# EAGLE board robot_board (EAGLE 6.5.0)
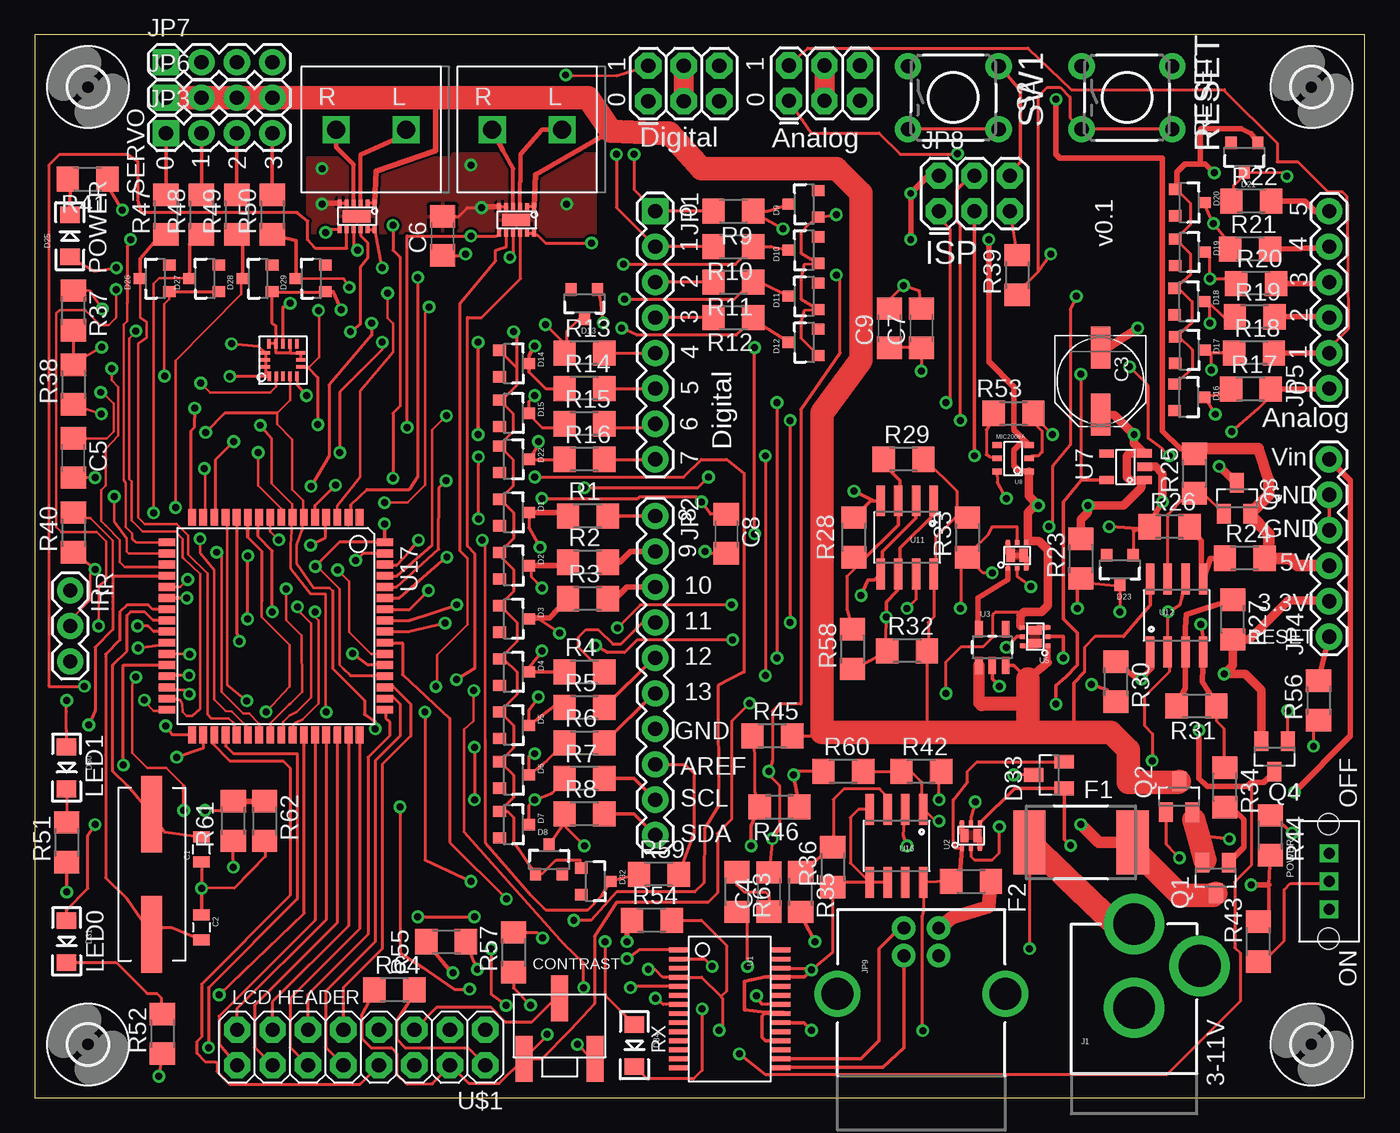
[diagram p1: board, top side]
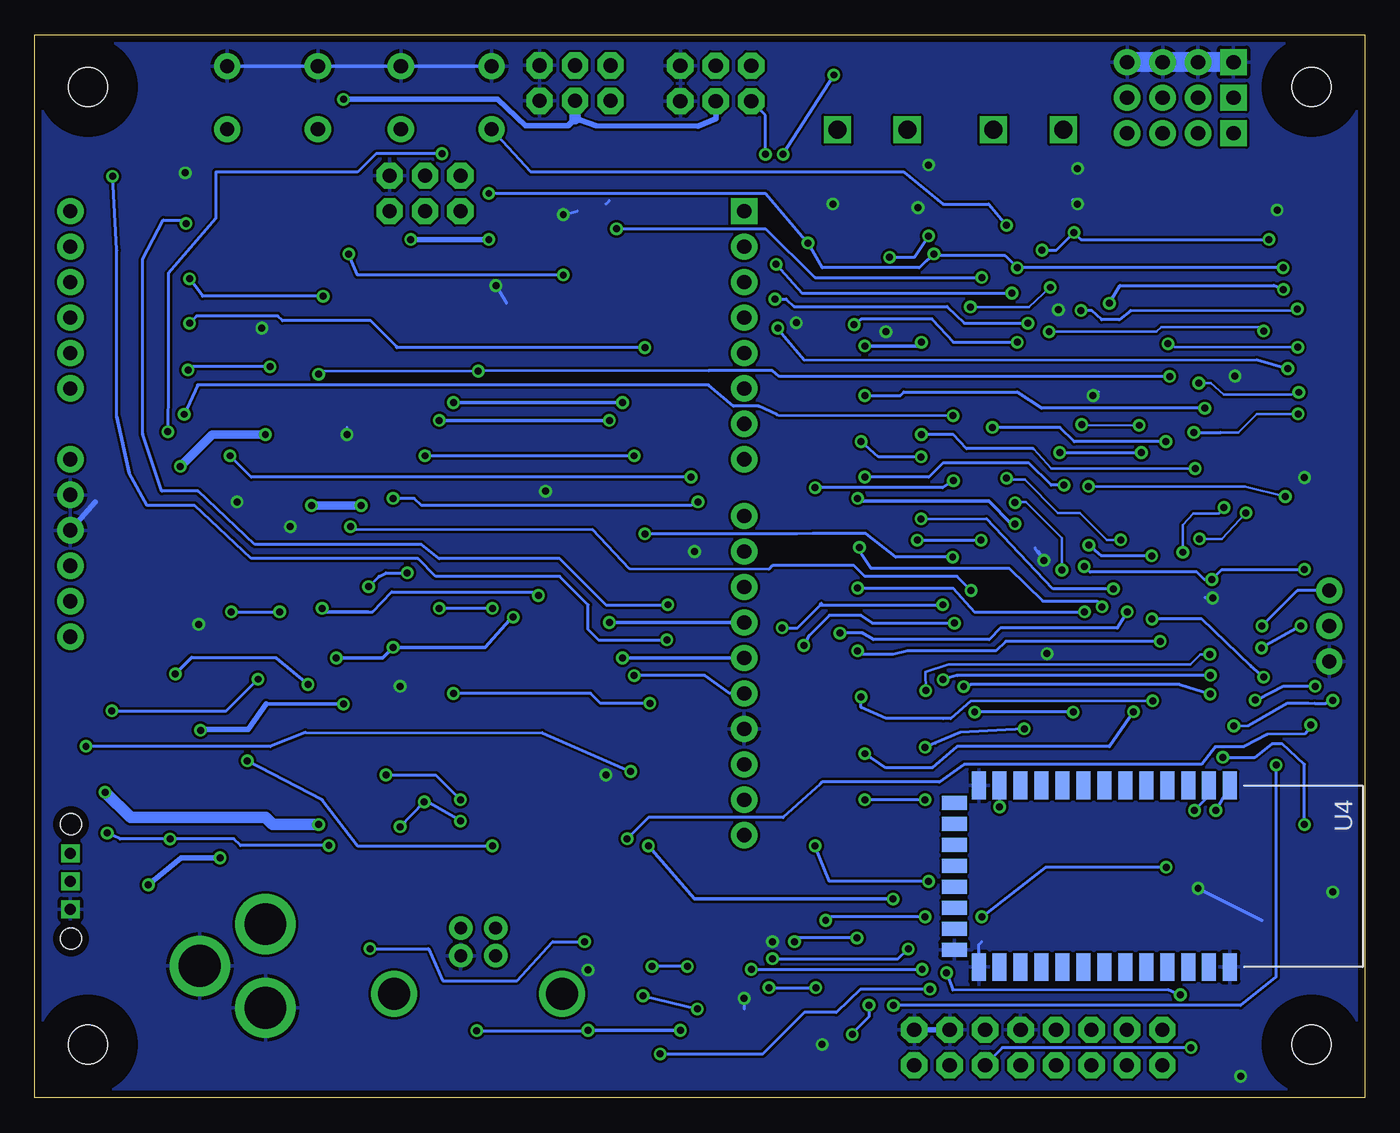
[diagram p2: board, bottom side, seen from below]

Size 95.24 x 76.12 mm. Coordinates in mm from the lower left corner, seen from the top.
Outline: 95.24,0 95.24,76.12 0,76.12 0,0 95.24,0
Copper layers (1*16): Top 0.035mm / dielectric 1.5mm / Bottom 0.035mm
Design rules "default *": minimum track width 7mil, minimum drill 19mil, track to track 7mil, track to pad 8mil, pad to pad 8mil, via to via 8mil, smd to smd 1mil, copper to edge 20mil, drill to drill 8mil, minimum pad ring 10mil, minimum via ring 8mil, stop-mask expansion 4mil, vias tented up to drill 0mil, thermal gap 10mil

## Footprints (pad centres in the part's own frame; a part is rotated, then mirrored left to right if it is on the bottom)
0805 = smd 0.8 x 1.2: 1 -0.9,0; 2 0.9,0
PANASONIC_D = smd 3 x 1.4: + 2.4,0; - -2.4,0
C1206 = smd 1.6 x 1.8: 1 -1.4,0; 2 1.4,0
SOT23-3 = smd 0.8 x 0.9: 1 -0.95,-1; 2 0.95,-1; 3 0,1.1
LED-1206 = smd 1.2 x 1.4: A -1.5,0; C 1.5,0
SOT23 = smd 1 x 1.4: 1 -0.95,-1.1; 2 0.95,-1.1; 3 0,1.1
SMD050F = smd 2.3 x 4.6: 1 -3.7,0; 2 3.7,0
R1206 = smd 1.6 x 1.803: 1 -1.422,0; 2 1.422,0
2,8 = hole 2.8: 0,0
1X03 = drill 1.016 pad 1.88: 1 0,0; 2 2.54,0; 3 5.08,0
POWER_JACK_PTH = drill 2.997 pad 4.318: GND 0,7.7; GNDBREAK 4.7,10.7; PWR 0,13.7
1X08 = drill 1.016 pad 1.88 square: 1 0,0 | drill 1.016 pad 1.88: 2 2.54,0; 3 5.08,0; 4 7.62,0; 5 10.16,0; 6 12.7,0; 7 15.24,0; 8 17.78,0
1X10 = drill 1.016 pad 1.88: 1 0,0; 2 2.54,0; 3 5.08,0; 4 7.62,0; 5 10.16,0; 6 12.7,0; 7 15.24,0; 8 17.78,0; 9 20.32,0; 10 22.86,0
1X04 = drill 1.016 pad 1.88 square: 1 0,0 | drill 1.016 pad 1.88: 2 2.54,0; 3 5.08,0; 4 7.62,0
1X06 = drill 1.016 pad 1.88: 1 0,0; 2 2.54,0; 3 5.08,0; 4 7.62,0; 5 10.16,0; 6 12.7,0
2X3 = drill 1.016 pad 1.88 octagon: 1 0,0; 2 0,2.54; 3 2.54,0; 4 2.54,2.54; 5 5.08,0; 6 5.08,2.54
USB-B-PTH = drill 0.914 pad 1.676: D+ 0,1.25; D- 1.981,1.25; GND 0,-1.25; VBUS 1.981,-1.25 | drill 2.286: S1 -2.718,-6.02; S2 -2.718,6.02
SW = drill 0.8 square: P$1 0,0; P$2 2,0; P$3 -2,0 | hole 1.5: -4.1,-0.04; 4.1,-0.04
SOT23@1 = smd 1 x 1.4: 1 -0.95,-1.1; 2 0.95,-1.1; 3 0,1.1
TACTILE-PTH = drill 1.016 pad 1.88: 1 -3.251,2.261; 2 3.251,2.261; 3 -3.251,-2.261; 4 3.251,-2.261
SSOP28DB = smd 0.348 x 1.397: 1 -4.225,-3.656; 2 -3.575,-3.656; 3 -2.925,-3.656; 4 -2.275,-3.656; 5 -1.625,-3.656; 6 -0.975,-3.656; 7 -0.325,-3.656; 8 0.325,-3.656; 9 0.975,-3.656; 10 1.625,-3.656; 11 2.275,-3.656; 12 2.925,-3.656; 13 3.575,-3.656; 14 4.225,-3.656; 15 4.225,3.656; 16 3.575,3.656; 17 2.925,3.656; 18 2.275,3.656; 19 1.625,3.656; 20 0.975,3.656; 21 0.325,3.656; 22 -0.325,3.656; 23 -0.975,3.656; 24 -1.625,3.656; 25 -2.275,3.656; 26 -2.925,3.656; 27 -3.575,3.656; 28 -4.225,3.656
SC70T = smd 0.3 x 0.35: D1 -0.65,0.89; D2 0.65,-0.94; G1 0,-0.94; G2 0,0.89; S1 -0.65,-0.94; S2 0.65,0.89 | smd 0.6 x 0.95: D1@ -0.47,-0.02; D2@ 0.46,-0.02
SOT23-5 = smd 0.55 x 1.2: 1 -0.95,-1.3; 2 0,-1.3; 3 0.95,-1.3; 4 0.95,1.3; 5 -0.95,1.3
BLUETOOTH_SMD = smd 2 x 1: 1 0,0; 2 0,-1.5; 3 0,-3; 4 0,-4.5; 5 0,-6; 6 0,-7.5; 7 0,-9; 8 0,-10.5; 9 0,-12; 10 0,-13.5; 11 0,-15; 12 0,-16.5; 13 0,-18; 22 13,-18; 23 13,-16.5; 24 13,-15; 25 13,-13.5; 26 13,-12; 27 13,-10.5; 28 13,-9; 29 13,-7.5; 30 13,-6; 31 13,-4.5; 32 13,-3; 33 13,-1.5; 34 13,0 | smd 1 x 1.8: 14 1.25,-19.75; 15 2.75,-19.75; 16 4.25,-19.75; 17 5.75,-19.75; 18 7.25,-19.75; 19 8.75,-19.75; 20 10.25,-19.75; 21 11.75,-19.75
SOT-23-5 = smd 1.05 x 0.6: P$1 0.53,2.24; P$2 0.53,1.29; P$3 0.53,0.34; P$4 3.23,2.24; P$5 3.23,0.35
SOT23-M5 = smd 0.4 x 0.7: P$1 -0.62,-0.35; P$2 0.33,-0.35; P$3 1.28,-0.35; P$4 1.28,1.94; P$5 0.33,1.94; P$6 -0.62,1.94
PWSON-N12 = smd 2 x 0.9: GND 0.82,0.63 | smd 0.28 x 0.5: P$1 -0.46,-0.32; P$2 0.04,-0.32; P$3 0.54,-0.32; P$4 1.04,-0.32; P$5 1.54,-0.32; P$6 2.04,-0.32; P$7 -0.46,1.58; P$8 0.04,1.58; P$9 0.54,1.58; P$10 1.04,1.58; P$11 1.54,1.58; P$12 2.04,1.58
SO08 = smd 0.61 x 2.21: 1 -1.905,-2.616; 2 -0.635,-2.616; 3 0.635,-2.616; 4 1.905,-2.616; 5 1.905,2.616; 6 0.635,2.616; 7 -0.635,2.616; 8 -1.905,2.616
TQFP64 = smd 1.194 x 0.559: 1 -7.8,6; 2 -7.8,5.2; 3 -7.8,4.4; 4 -7.8,3.6; 5 -7.8,2.8; 6 -7.8,2; 7 -7.8,1.2; 8 -7.8,0.4; 9 -7.8,-0.4; 10 -7.8,-1.2; 11 -7.8,-2; 12 -7.8,-2.8; 13 -7.8,-3.6; 14 -7.8,-4.4; 15 -7.8,-5.2; 16 -7.8,-6; 33 7.8,-6; 34 7.8,-5.2; 35 7.8,-4.4; 36 7.8,-3.6; 37 7.8,-2.8; 38 7.8,-2; 39 7.8,-1.2; 40 7.8,-0.4; 41 7.8,0.4; 42 7.8,1.2; 43 7.8,2; 44 7.8,2.8; 45 7.8,3.6; 46 7.8,4.4; 47 7.8,5.2; 48 7.8,6 | smd 0.559 x 1.194: 17 -6,-7.8; 18 -5.2,-7.8; 19 -4.4,-7.8; 20 -3.6,-7.8; 21 -2.8,-7.8; 22 -2,-7.8; 23 -1.2,-7.8; 24 -0.4,-7.8; 25 0.4,-7.8; 26 1.2,-7.8; 27 2,-7.8; 28 2.8,-7.8; 29 3.6,-7.8; 30 4.4,-7.8; 31 5.2,-7.8; 32 6,-7.8; 49 6,7.8; 50 5.2,7.8; 51 4.4,7.8; 52 3.6,7.8; 53 2.8,7.8; 54 2,7.8; 55 1.2,7.8; 56 0.4,7.8; 57 -0.4,7.8; 58 -1.2,7.8; 59 -2,7.8; 60 -2.8,7.8; 61 -3.6,7.8; 62 -4.4,7.8; 63 -5.2,7.8; 64 -6,7.8
2X8 = drill 1.016 pad 1.88 octagon: 1 0,0; 2 0,2.54; 3 2.54,0; 4 2.54,2.54; 5 5.08,0; 6 5.08,2.54; 7 7.62,0; 8 7.62,2.54; 9 10.16,0; 10 10.16,2.54; 11 12.7,0; 12 12.7,2.54; 13 15.24,0; 14 15.24,2.54; 15 17.78,0; 16 17.78,2.54
POT = smd 1.194 x 3.302: 1 -2.54,0; 2 0,4.318; 3 2.54,0
QFN-COL = smd 0.67 x 0.25: P$1 -1.17,0.99; P$2 -1.17,0.49; P$3 -1.17,-0.01; P$4 -1.17,-0.51; P$5 -1.17,-1.01; P$9 1.17,-1; P$10 1.17,-0.5; P$11 1.17,0; P$12 1.17,0.5; P$13 1.17,1 | smd 0.25 x 0.67: P$6 -0.5,-1.26; P$7 0,-1.26; P$8 0.5,-1.26; P$14 0.5,1.26; P$15 0,1.26; P$16 -0.5,1.26
2POS_TERMINAL = drill 1.3 square: L -5,0; R 0,0
CRYSTAL-SMD-10.5X4.8-2PIN = smd 5.5 x 1.5: P$1 -4.3,0; P$2 4.3,0

## Placement (x,y rotation side)
C1  22pF  [0805]  11.93,17.78 90 top
C2  22pF  [0805]  11.93,12.19 270 top
C3  100uF  [PANASONIC_D]  76.32,51.33 270 top
C4  .1uF  [C1206]  52.57,14.73 90 top
C5  .1uF  [C1206]  2.76,45.82 270 top
C6  .1uF  [C1206]  29.2,61.72 90 top
C7  22uF  [C1206]  63.49,55.12 90 top
C8  .1uF  [C1206]  49.52,40.39 270 top
C9  1uF  [C1206]  61.2,55.12 90 top
D1  5.1V  [SOT23-3]  34.28,41.91 270 top
D2  5.1V  [SOT23-3]  34.28,38.1 270 top
D3  5.1V  [SOT23-3]  34.28,34.29 270 top
D4  5.1V  [SOT23-3]  34.28,30.48 270 top
D5  5.1V  [SOT23-3]  34.28,26.67 270 top
D6  5.1V  [SOT23-3]  34.28,23.11 270 top
D7  5.1V  [SOT23-3]  34.28,19.56 270 top
D8  5.1V  [SOT23-3]  36.82,17.02 0 top
D9  5.1V  [SOT23-3]  55.11,64.01 90 top
D10  5.1V  [SOT23-3]  55.11,60.71 90 top
D11  5.1V  [SOT23-3]  55.11,57.4 90 top
D12  5.1V  [SOT23-3]  55.11,54.1 90 top
D13  5.1V  [SOT23-3]  39.36,56.9 180 top
D14  5.1V  [SOT23-3]  34.28,52.58 270 top
D15  5.1V  [SOT23-3]  34.28,49.02 270 top
D16  5.1V  [SOT23-3]  82.64,50.16 270 top
D17  5.1V  [SOT23-3]  82.67,53.54 270 top
D18  5.1V  [SOT23-3]  82.64,57.02 270 top
D19  5.1V  [SOT23-3]  82.67,60.55 270 top
D20  5.1V  [SOT23-3]  82.67,64.11 270 top
D21  5.1V  [SOT23-3]  86.63,67.39 180 top
D22  5.1V  [SOT23-3]  34.28,45.72 270 top
D23  2.4V  [SOT23-3]  77.71,37.85 180 top
D25  POWER  [LED-1206]  2.5,61.72 90 top
D26  5.1V  [SOT23-3]  8.63,58.67 90 top
D27  5.1V  [SOT23-3]  12.18,58.67 90 top
D28  5.1V  [SOT23-3]  15.99,58.67 90 top
D29  5.1V  [SOT23-3]  19.8,58.67 90 top
D30  GREEN  [LED-1206]  2.28,23.62 270 top
D31  YELLOW  [LED-1206]  2.28,11.18 270 top
D32  5.1V  [SOT23-3]  40.12,15.49 270 top
D33  BAT54C  [SOT23]  72.63,23.11 90 top
D34  RX  [LED-1206]  42.94,3.73 270 top
F1  2920L200  [SMD050F]  74.92,18.29 0 top
F2  1206PPTC_FUSE  [R1206]  67.05,15.49 180 top
H1  MOUNT-HOLE2.8  [2,8]  3.8,3.81 90 top
H2  MOUNT-HOLE2.8  [2,8]  3.8,72.39 90 top
H3  MOUNT-HOLE2.8  [2,8]  91.43,3.81 90 top
H4  MOUNT-HOLE2.8  [2,8]  91.43,72.39 90 top
IR  [1X03]  2.53,36.32 270 top
J1  POWER_JACKPTH  [POWER_JACK_PTH]  78.73,-1.27 0 top
JP1  [1X08]  44.44,63.5 270 top
JP2  M10"  [1X10]  44.44,41.66 270 top
JP3  [1X04]  9.39,69.09 0 top
JP4  [1X06]  92.7,33.02 90 top
JP5  [1X06]  92.7,50.8 90 top
JP6  [1X04]  9.39,71.63 0 top
JP7  [1X04]  9.39,74.17 0 top
JP8  [2X3]  64.76,63.5 0 top
JP9  USB-B  [USB-B-PTH]  63.49,10.16 90 top
JP10  [2X3]  54.02,71.4 0 top
JP11  [2X3]  43.93,71.37 0 top
POWER  SW  [SW]  92.7,15.49 270 top
Q1  DMP2035U  [SOT23]  84.57,15.75 180 top
Q2  DMP2035U  [SOT23]  81.96,21.56 0 top
Q3  DMP2035U-7  [SOT23@1]  86.1,42.93 0 top
Q4  DMP2035U-7  [SOT23@1]  88.79,24.43 180 top
R1  300  [R1206]  39.61,41.66 0 top
R2  300  [R1206]  39.61,38.35 0 top
R3  300  [R1206]  39.61,35.74 0 top
R4  300  [R1206]  39.36,30.48 0 top
R5  300  [R1206]  39.36,27.94 0 top
R6  300  [R1206]  39.36,25.4 0 top
R7  300  [R1206]  39.36,22.86 0 top
R8  300  [R1206]  39.36,20.32 0 top
R9  300  [R1206]  50.03,63.5 180 top
R10  300  [R1206]  50.03,60.96 180 top
R11  300  [R1206]  50.03,58.42 180 top
R12  300  [R1206]  50.03,55.88 180 top
R13  300  [R1206]  39.36,53.34 0 top
R14  300  [R1206]  39.36,50.8 0 top
R15  300  [R1206]  39.36,48.26 0 top
R16  300  [R1206]  39.36,45.72 0 top
R17  300  [R1206]  87.09,50.75 0 top
R18  300  [R1206]  87.32,53.34 0 top
R19  300  [R1206]  87.37,55.93 0 top
R20  300  [R1206]  87.47,58.32 0 top
R21  300  [R1206]  87.04,60.78 0 top
R22  300  [R1206]  87.11,64.21 0 top
R23  20K 1%  [R1206]  74.92,38.61 90 top
R24  27K 1%  [R1206]  86.65,38.63 0 top
R25  20K 1%  [R1206]  83.05,44.7 90 top
R26  20K 1%  [R1206]  81.27,40.89 0 top
R27  10K 1%  [R1206]  85.79,34.24 270 top
R28  10K 1%  [R1206]  58.66,40.13 270 top
R29  12K 1%  [R1206]  62.22,45.72 0 top
R30  20K 1%  [R1206]  77.43,29.79 270 top
R31  20K 1%  [R1206]  83.2,28.07 180 top
R32  20K 1%  [R1206]  62.47,32 0 top
R33  20K 1%  [R1206]  66.79,40.13 90 top
R34  20K 1%  [R1206]  85.23,22.23 270 top
R35  5.11K 1%  [R1206]  54.85,14.73 270 top
R36  20K 1%  [R1206]  57.14,16.51 90 top
R37  4.7K  [R1206]  2.76,56.39 270 top
R38  4.7K  [R1206]  2.76,51.08 90 top
R39  1K  [R1206]  70.35,58.93 90 top
R40  10K 1%  [R1206]  2.76,40.49 90 top
R41  330  [R1206]  3.77,65.79 180 top
R42  10K 1%  [R1206]  63.49,23.37 0 top
R43  1K  [R1206]  87.62,11.18 270 top
R44  100K  [R1206]  88.48,18.8 270 top
R45  10K 1%  [R1206]  52.82,25.91 0 top
R46  10K 1%  [R1206]  53.33,20.83 180 top
R47  300  [R1206]  9.39,63.25 90 top
R48  300  [R1206]  11.93,63.25 90 top
R49  300  [R1206]  14.47,63.25 90 top
R50  300  [R1206]  17.01,63.25 90 top
R51  330  [R1206]  2.28,18.29 90 top
R52  330  [R1206]  9.13,4.57 90 top
R53  1.5K  [R1206]  70.09,49.02 180 top
R54  10K 1%  [R1206]  44.19,12.7 0 top
R55  1K  [R1206]  29.45,11.18 180 top
R56  1K  [R1206]  91.94,28.45 90 top
R57  330  [R1206]  34.28,10.41 90 top
R58  300K 1%  [R1206]  58.56,32.13 90 top
R59  1K  [R1206]  44.69,16 0 top
R60  300K 1%  [R1206]  57.9,23.37 0 top
R61  1K  [R1206]  14.21,19.81 270 top
R62  2K  [R1206]  16.45,19.81 90 top
R63  1K  [R1206]  50.28,14.73 270 top
R64  10  [R1206]  25.75,7.72 0 top
RESET  [TACTILE-PTH]  78.22,71.63 0 top
S2  [TACTILE-PTH]  65.78,71.63 0 top
U1  FT232RL-BASICSSOP  [SSOP28DB]  49.77,6.35 270 top
U2  SIA907EDJT  [SC70T]  67.05,18.8 0 top
U3  MIC5219  [SOT23-5]  68.57,32.26 0 top
U4  HC_05  [BLUETOOTH_SMD]  9.64,22.35 270 bottom
U5  SIA907EDJT  [SC70T]  71.62,33.02 90 top
U6  SIA907EDJT  [SC70T]  70.35,38.86 0 top
U7  TLV70233  [SOT-23-5]  80,46.48 180 top
U8  MIC2009A  [SOT23-M5]  70.86,45.47 90 top
U9  DRV8839  [PWSON-N12]  35.3,63.5 180 top
U10  DRV8839  [PWSON-N12]  23.87,63.75 180 top
U11  LM393  [SO08]  62.47,40.13 180 top
U12  LM393  [SO08]  81.78,34.54 0 top
U16  LM393  [SO08]  61.71,18.03 180 top
U17  ATMEGA325PA  [TQFP64]  17.26,33.78 270 top
U$1  M08X2  [2X8]  32.26,4.86 180 top
U$2  POT  [POT]  37.58,2.79 0 top
U$8  MMA8453Q  [QFN-COL]  17.77,52.83 90 top
U$19  2POS_TERMINAL  [2POS_TERMINAL]  32.76,69.34 180 top
U$20  2POS_TERMINAL  [2POS_TERMINAL]  21.58,69.34 180 top
Y1  16MHz  [CRYSTAL-SMD-10.5X4.8-2PIN]  8.37,16 270 top

## Tracks (layer width: path | path; a pad name or v marks a point on that pad's centre or on a via)
2.4V  (via drill 0.5)
  Top 0.203: 82.13,35.81 81.96,35.26 v81.17,34.8 81.14,34.42 U12.2 81.27,31.8 81.27,30.5 79.47,28.7 79.47,26.64 80.05,26.06 80.05,24.51 v80.02,24.13 | v62.47,18.03 62.22,18.8 U16.2 | 75.2,36.91 77.71,36.65 | 77.71,36.65 D23.3 | 77.71,36.65 v77.71,34.8
  Top 0.254: 75.2,36.91 R23.1 74.67,36.68 v74.67,35.05 | v59.17,35.97 59.68,37.08 60.14,37.08 U11.5 60.7,37.64 60.7,39.12 63.11,41.53 U11.2 | 82.13,35.81 82.36,36.91 U12.6
  Bottom 0.203: v81.17,34.8 v77.71,34.8 | v62.47,18.03 72.13,18.03 74.67,21.34 v80.02,24.13 | 71.36,34.8 71.06,34.8 69.69,36.22 59.38,36.22 v59.17,35.97
  Bottom 0.254: 71.36,34.8 74.41,34.8 v74.67,35.05
3V3  (via drill 0.5)
  Top 0.178: v4.79,53.75 2.99,52.73 R38.2
  Top 0.203: R37.2 R38.2 | v14.09,54 15.99,53.85 U$8.P$14 U$8.P$15 U$8.P$16 16.51,51.93 U$8.P$1 14.62,51.66 v13.96,51.66 | v74.92,51.82 74.92,44.5 75.17,44.24 | v26.15,20.83 26.15,10.36 27.7,9.37 30.04,7.77 v31.13,7.77 | v63.49,52.05 C7.1 C9.1 | v50.46,3.12 52.37,1.63 81.07,1.63 86.32,6.88 86.32,10.36 85.94,10.74 85.94,15.44 87.14,16.64 87.14,22.58
  Top 0.254: U7.P$4 75.17,44.24 74.97,44.24 73.65,42.67 73.65,34.29 74.67,33.27 74.67,30.99 73.83,30.15 73.14,29.52 v73.14,28.19
  Top 0.406: Q4.3 88.03,22.58 87.14,22.58 86.83,22.28 83.96,22.28 83.38,22.86 v83.38,26.31
  Bottom 0.178: v4.79,53.75 13.6,53.75 v14.09,54 | 46.98,52.07 63.24,52.07 v63.49,52.05 74.69,52.05 v74.92,51.82
  Bottom 0.203: U4.12 26.14,22.11 26.15,22.1 v26.15,20.83 | v31.13,7.77 36.11,7.77 37.84,6.1 40.12,6.1 43.09,3.12 v50.46,3.12 | v13.96,51.66 41.9,51.66 42.41,52.07 46.98,52.07
  Bottom 0.254: v73.14,28.19 78.68,28.19
  Bottom 0.406: 78.68,28.19 79.97,26.39 83.35,26.39 v83.38,26.31
3V3_OUT  (via drill 0.5)
  Top 0.203: 87.77,25.6 Q4.2
  Top 0.254: v75.68,29.59 76.8,29.21 R30.2
  Top 0.61: JP4.2 92.65,35.61 89.78,35.61 86.98,32.82 R27.2 85.79,30.96 v85.18,30.35 86.68,30.35 87.85,29.18 87.85,25.55 Q4.2
  Bottom 0.254: v85.18,30.35 84.01,31.52 77.97,31.5 v75.68,29.59
5V  (via drill 0.5)
  Top 0.203: D25.A 4.28,59.21 v5.83,59.44 | v24.88,59.44 24.37,62.13 U10.P$7 U10.P$8 | U9.P$8 U9.P$7 36.01,61.77 36.57,61.21 v39.87,61.21 | U8.P$1 70.95,44.8 | 75.43,40.28 R23.2 | 79.26,44.45 U7.P$1 | U6.S2 71.49,39.75 | 70.6,34.29 70.6,34.54 70.35,34.8 68.82,34.8 68.62,34.59 68.62,32.99 67.93,32.31 66.36,32.31 65.27,31.22 v65.27,28.96 | 34.57,2.32 U$2.1 | U$2.1 36.31,2.79 38.34,4.83 40.07,6.73 40.07,11.56 41.65,13.97 48.2,13.97 48.89,14.66 48.89,18.92 49.93,19.96 49.93,26.98 v51.2,28.25 | R57.1 34.28,7.85 v35.5,6.63 | v36.69,4.52 36.69,4.45 U$2.1 | R64.1 24.15,7.32 23.38,5.92 23.38,4.27 24.07,3.58 25.54,3.58 25.9,3.17 25.9,1.68 26.63,0.99 28.47,0.99 28.49,1.02 U$1.4 29.78,2.32 31.08,1.02 33.26,1.02 U$2.1 | C6.1 30.75,60.32 v30.85,60.43
  Top 0.305: 71.11,40.13 71.11,39.86 U6.S2 | 70.6,33.8 U5.S2
  Top 0.406: JP8.2 64,66.04 v62.73,64.77 v62.73,61.47 | v68.32,61.47 68.32,52.7 70.12,50.9 70.12,47.83 U8.P$3 70.48,46.75 70.12,46.38 70.12,45.26 70.5,44.88 71.17,44.88 U8.P$1
  Top 0.61: U8.P$1 71.21,43.08 v71.87,42.42 71.62,42.42 71.11,41.91 71.11,40.13 | 74.92,40.39 R23.2 74.92,41.4 75.43,41.91 v75.43,42.42 77.97,42.42 79.24,43.69 79.24,44.01 U7.P$1 79.42,44.2 78.48,44.2 78.22,44.45 78.22,45.97 78.39,46.14 U7.P$3 78.73,46.88 v78.73,47.5 77.32,48.91 C3.+ | Q3.3 v84.83,45.21 | 71.11,39.86 71.91,39.86 72.56,39.22 72.56,35.26 72.07,34.77 70.83,34.77 70.6,34.54 | 70.6,34.29 70.6,33.8
  Bottom 0.203: v5.83,59.44 v24.88,59.44 25.75,60.3 30.72,60.3 v30.85,60.43 31.41,59.92 31.89,59.44 38.85,59.44 v39.87,61.21 42.92,64.77 v62.73,64.77 | v65.27,28.96 55.44,28.96 54.73,28.25 v51.2,28.25 | v35.5,6.63 35.5,5.79 36.72,4.57 36.72,4.55 v36.69,4.52
  Bottom 0.406: v62.73,61.47 v68.32,61.47
  Bottom 0.61: v75.43,42.42 v71.87,42.42 | v84.83,45.21 82.54,47.5 v78.73,47.5
5V_OUT  (via drill 0.5)
  Top 0.406: R24.2 89.08,38.61 | v73.14,71.5 73.14,67.56 73.4,67.31 80.76,67.31 80.76,47.75 82.03,46.48 83.91,46.48 | 83.91,46.48 R25.2 82.69,46.23 83.91,46.48
  Top 0.813: JP4.3 90.41,38.1 89.91,38.61 R24.2 88.38,38.76 88.38,40.39 87.05,41.72 Q3.2 88.38,43.16 88.38,44.2 87.62,46.48 83.91,46.48
  Top 1.422: JP11.4 JP11.3 | JP10.4 JP10.3
  Bottom 0.406: v73.14,71.5 62.09,71.5 60.09,69.62 57.06,69.62 56.56,70.13 56.18,70 | 56.56,70.38 56.18,70 | 56.18,70 55.03,69.62 47.74,69.6 46.47,70.1 JP11.3
  Bottom 0.813: JP10.3 56.56,70.13
5V_UC  (via drill 0.5)
  Top 0.178: U17.21 10.41,36.58 v10.94,37.11 | 24.47,39.78 24.32,39.78 | 22.09,30.73 21.83,30.99 21.83,36.45 20.41,37.87 20.26,37.87 v20.08,38.05 | 25.03,40.01 U17.64 | IR.2 2.53,34.21 3.98,35.66 3.98,37.52 v4.31,37.85
  Top 0.203: 24.47,39.78 U17.64 25.14,39.86 | 22.09,30.73 22.6,30.23 25.02,30.23 U17.52 | U17.21 | R40.1 v4.31,37.85 | U8.P$6 68.94,44.08 v69.59,42.93 | C8.1 48.37,41.79 v47.74,42.67 47.36,43.05 43.32,43.05 43.2,42.93 v36.31,42.93 | 24.32,39.78 21.81,39.78 v20.08,38.05
  Top 0.254: 25.03,40.01 v25.03,41.1
  Bottom 0.178: v4.31,37.85 4.38,37.85 4.44,37.8
  Bottom 0.203: v69.59,42.93 68.06,42.93 67.55,42.42 48.25,42.42 v47.74,42.67 | 4.44,37.8 10.25,37.8 v10.94,37.11 11.47,37.11 12,37.64 19.67,37.64 v20.08,38.05
  Bottom 0.254: v25.03,41.1 25.29,41.1 26.91,42.72 36.11,42.72 v36.31,42.93
5VREG_SW  (via drill 0.5)
  Top 0.203: U11.7 63.11,35.69 v62.47,35.05 | v66.28,35.05 66.36,35.31 66.36,38.96 | U6.G2 70.35,40.89 68.57,40.89 68.32,40.39 67.05,39.12 | R33.1 66.79,38.86 67.05,39.12 | 67.05,39.12 66.36,38.96 | 66.36,38.96 R33.1 | U6.G1 70.35,37.34 v71.34,36.6 | v68.57,37.59 67.91,37.59 R33.1
  Bottom 0.203: v62.47,35.05 v66.28,35.05 | v71.34,36.6 70.6,37.34 70.09,37.59 v68.57,37.59
5VREG_SWO  (via drill 0.5)
  Top 0.203: R58.1 59.73,31.29 R32.1 60.9,32.49 60.95,32.82 v60.98,34.42
  Top 0.254: U5.G1 73.65,33.02 v73.65,31.5 | v60.98,34.42 60.98,35.51 61.79,36.32 U11.6 61.97,37.64 61.97,39.37 64.38,41.78 U11.1 | U5.G2 70.35,33.02 v69.59,32.26
  Bottom 0.254: v73.65,31.5 70.35,31.5 v69.59,32.26 62.98,32.26 60.95,34.54 v60.98,34.42
A0  (via drill 0.5)
  Top 0.203: JP10.1 55.62,69.09 60.47,69.09 61.99,67.56 66.03,67.56 v66.08,67.61 | v85.71,47.7 87.62,49.35 89.02,50.75
  Top 0.406: R17.2 89.02,50.75 92.65,50.75 JP5.1
  Bottom 0.203: v85.71,47.7 85.69,51 85.69,59.03 82.29,62.97 82.29,66.29 72.13,66.29 70.8,67.61 v66.08,67.61
A0_IN  (via drill 0.5)
  Top 0.178: 28.44,39.55 28.44,47.8 v29.48,48.84
  Top 0.203: U17.61 25.94,37.38 28.44,39.55 | v84.55,48.95 83.81,50.26 | 83.81,50.26 D16.3 | 83.81,50.26 85.35,50.44 R17.1
  Bottom 0.178: v29.48,48.84 41.95,48.84 42.1,48.92
  Bottom 0.203: 42.1,48.92 43.42,49.53 45.2,49.53 46.98,51.05 83.58,51.05 v84.55,48.95
A1
  Top 0.203: R18.2 92.34,53.34 94.1,55.09 94.05,63.96 93.97,64.03 93.97,64.57 93.64,64.9 92.6,64.9 90.46,67.03 88.97,67.03 88.99,67.06 88.99,68.35 85.21,72.14 85.21,72.21 74.23,72.21 71.13,75.18 55.36,75.18 JP10.2
  Top 0.406: R18.2 JP5.2
A1_IN  (via drill 0.5)
  Top 0.203: U17.60 25.9,36.58 28.92,39.29 28.95,43.69 v29.45,44.2 | 80.76,46.48 80.56,46.63 | 80.56,46.63 79.75,47.24 79.75,51 v78.4,52.35 | v39.36,43.69 47.49,43.69 v48.25,44.45 | v81.27,45.97 81.22,45.97 80.56,46.63 | R18.1 84.2,53.34 D17.3 84.27,53.27 v84.27,52.12
  Bottom 0.203: v29.45,44.2 30.22,43.69 v39.36,43.69 | v48.25,44.45 79.75,44.45 v81.27,45.97 | v78.4,52.35 84.04,52.35 v84.27,52.12
A2
  Top 0.406: R19.2 92.65,55.93 JP5.3
A2_IN  (via drill 0.5)
  Top 0.203: U17.59 26.12,35.78 v29.5,38.71 | v51.55,40.39 v51.55,53.72 | v84.17,55.47 84.17,56.7 D18.3 84.06,57 85.1,55.96 85.92,55.96 R19.1
  Bottom 0.203: v29.5,38.71 33.57,38.71 35.73,40.41 39.54,40.41 40.63,40.39 v51.55,40.39 | v51.55,53.72 69.33,53.72 69.33,53.8 71.19,55.65 77.51,55.65 77.84,55.98 83.66,55.98 v84.17,55.47
A3
  Top 0.406: R20.2 92.6,58.32 JP5.4
A3_IN  (via drill 0.5)
  Top 0.203: U17.58 26.84,34.98 v28.18,36.32 | v72.63,40.89 72.89,41.15 72.89,45.21 74.16,46.74 74.16,56.46 v74.59,57.4 | R20.1 85.71,58.65 v84.17,58.65 84.17,60.16 D19.3
  Bottom 0.203: v28.18,36.32 29.2,37.34 35.8,37.34 36.57,38.1 42.41,38.1 42.66,37.85 52.64,37.87 55.31,40.69 72.51,40.66 | v74.59,57.4 83.23,57.4 v84.17,58.65
  Bottom 0.254: 72.51,40.66 v72.63,40.89
A4
  Top 0.406: R21.2 90.67,60.81 91,60.86 92.6,60.86 JP5.5
A4_IN  (via drill 0.5)
  Top 0.203: U17.57 26.81,34.18 v30.22,35.31 | D20.3 84.01,63.46 v84.42,62.61 85.61,61.09 R21.1 | v49.9,35.31 43.37,35.31 v41.72,33.66
  Bottom 0.203: v84.42,62.61 84.65,62.87 86.05,62.87 87.52,60.07 87.52,47.55 86.15,43.43 83.56,43.43 79.49,39.62 67.55,39.62 66.28,38.61 57.65,38.61 54.35,35.31 v49.9,35.31 | v41.72,33.66 40.61,33.66 38.88,35.38 38.93,35.38 39,35.31 v30.22,35.31
A5
  Top 0.406: R22.2 90.95,64.21 91.71,63.45 92.65,63.45 JP5.6
A5_IN  (via drill 0.5)
  Top 0.203: U17.56 26.77,33.38 v29.38,33.98 | R22.1 85.87,64.34 85.87,65.33 86.63,66.09 86.64,66.22 D21.3 89.41,66.26 v89.68,65.99 | v49.98,32.79 43.12,32.77 42.23,31.88 41.01,31.88 v40.17,32.38
  Bottom 0.203: 88.48,44.76 87.21,42.42 83.81,42.42 79.75,38.63 67.81,38.61 66.54,37.34 57.65,37.34 55.62,35.31 55.62,33.53 54.85,32.77 v49.98,32.79 | v29.38,33.98 35.27,33.98 36.06,34.54 38.34,34.54 39.78,33.11 v40.17,32.38 | 89.37,48.77 89.37,60.71 v89.68,65.99
  Bottom 0.254: 89.37,48.77 88.48,44.76
ACCEL_INT  (via drill 0.5)
  Top 0.178: v4.56,33.78 4.56,36.65 5.12,37.06 5.12,39.83 4.44,40.51 1.9,40.51 1.54,40.87 1.54,56.19 1.77,56.41 3.6,56.41 4.66,55.35 5.27,55.35 5.81,55.88 v5.81,57.89
  Top 0.203: U$8.P$11 17.77,56.64 v18.28,56.9 | v7.38,32.21 9.39,32.51 U17.26
  Bottom 0.203: v18.28,56.9 17.52,58.17 6.52,58.17 v5.81,57.89 | v4.56,33.78 v7.38,32.21
AOUT1
  Top 0.279: U9.P$3 34.76,65.6 34.79,65.63
  Top 0.305: U$19.L 36.31,69.34 34.79,67.56 34.79,65.63
AOUT2
  Top 0.279: U9.P$4 34.26,66.52
  Top 0.305: 34.26,66.52 33.52,67.82 U$19.R
AREF
  Top 0.203: JP2.8 46.57,23.88 47.21,23.22 47.21,19 R59.2
AREF_IN  (via drill 0.5)
  Top 0.178: 32.25,25.65 32.25,39.73 v32.05,39.93
  Top 0.203: v27.47,39.93 26.81,39.09 25.9,38.1 25.14,38.1 U17.62 | 32.25,25.65 32.25,18.29 35.55,14.48 36.57,13.46 39.61,13.46 40.63,14.48 40.88,14.9 D32.3 42.24,15.75 R59.1
  Bottom 0.203: v32.05,39.93 v27.47,39.93
BOUT1
  Top 0.279: U10.P$3 23.33,67.53
  Top 0.305: 23.33,67.53 25.64,68.58 26.66,69.26 U$20.L
BOUT2
  Top 0.279: U10.P$4 22.83,66.83
  Top 0.305: 22.83,66.83 21.58,68.07 U$20.R
BT_RX  (via drill 0.5)
  Top 0.203: U17.5 20.06,42.42 v21.53,43.87 | v35.8,44.45 46.47,44.45 47.74,45.72 49.52,45.72 50.79,44.7 50.79,30.48 48.94,29.52 48.96,20.9 47.95,19.25 47.92,15.44 47.95,15.42 47.26,14.73 41.65,14.73 39.84,12.7 v38.6,12.7 | v27.42,12.95 v31.49,12.95 | R61.2 14.11,18.39 v14.21,16.51
  Bottom 0.203: v21.53,43.87 22.44,43.87 24.04,45.44 30.19,45.47 31.21,44.45 v35.8,44.45 | v27.42,12.95 22.85,16.51 v14.21,16.51 | v31.49,12.95 38.34,12.95 v38.6,12.7
BT_TX  (via drill 0.5)
  Top 0.178: v7.23,30.12 7,29.74 6.98,29.41 6.98,24.69 8.04,23.62 9.39,23.62 10.66,22.35
  Top 0.203: v15.23,34.29 v15.26,38.81 | v19.75,39.57 20.39,39.9 20.82,40.13 20.82,41.54 U17.4 | v10.66,20.57 10.66,22.35
  Bottom 0.203: v7.23,30.12 8.14,30.94 11.67,34.29 v15.23,34.29 | v15.26,38.81 18.84,38.81 v19.75,39.57 | U4.1 v10.66,20.57
D0  (via drill 0.5)
  Top 0.203: R9.2 JP1.1 42.92,65.02 v42.92,67.56
  Bottom 0.203: v42.92,67.56 42.92,70.36 JP11.1
D0_IN  (via drill 0.5)
  Top 0.203: D9.3 52.48,63.5 R9.1 51.81,63.25 v53.58,62.23 | v27.42,58.75 27.42,44.45 26.84,43.56 23.79,43.56 22.6,42.44 22.6,41.72 U17.2 22.46,41.01
  Bottom 0.203: v53.58,62.23 42.92,62.23 39.36,58.75 v27.42,58.75
D1  (via drill 0.5)
  Top 0.203: R10.2 JP1.2 41.65,63.75 v41.65,67.56 | v38.01,73.25 41.65,73.2 JP11.2
  Bottom 0.203: v41.65,67.56 v38.01,73.25
D1_IN  (via drill 0.5)
  Top 0.178: v25.26,57.63 25.26,55.85 25.67,55.45 25.67,53.39 23.31,50.6 23.31,44.45 21.63,42.37 U17.3
  Top 0.203: D10.3 52.74,60.96 R10.1 50.18,59.69 v42.15,59.69
  Bottom 0.203: v42.15,59.69 40.3,57.63 v25.26,57.63
D2
  Top 0.203: R11.2 JP1.3
D2_IN  (via drill 0.5)
  Top 0.178: v5.68,43.05 5.68,41.27 6.57,40.06 6.57,39.12 6.72,38.96 9.44,38.96 U17.18
  Top 0.203: R11.1 51.98,58.42 D11.3 | R11.1 51.7,58.01 | v24.12,55.47 24.12,54.61 21.07,51.05 21.07,45.97 v19.78,43.79 | 9.34,38.86 U17.18 | R11.1 51.32,58.42 50.08,57.17 42.26,57.17 v42.23,57.2
  Bottom 0.178: v19.78,43.79 8.58,43.79 v5.68,43.05
  Bottom 0.203: v24.12,55.47 28.67,55.47 29.91,56.67 40.86,56.67 41.39,57.15 41.44,57.2 v42.23,57.2
D3
  Top 0.203: R12.2 JP1.4
D3_IN  (via drill 0.5)
  Top 0.178: U17.19 9.28,38 6.44,38 6.09,38.35 6.09,39.93 5.07,41 4.77,41.3 4.77,43.54 5.07,43.84 5.07,46.46 5.98,47.42 5.98,50.9 5.5,51.38 v5.5,52.22
  Top 0.203: D12.3 51.21,55.88 R12.1 51.45,55.73 50.23,54.61 43.12,54.61 v42.03,55.12 | 9.38,38.1 U17.19
  Bottom 0.203: v5.5,52.22 7.74,52.86 40.12,52.83 41.58,54.55 v42.03,55.12
D4
  Top 0.203: R13.2 JP1.5
D4_IN  (via drill 0.5)
  Top 0.178: v15.99,46.2 15.99,43.84 17.64,42.19 17.64,41.6 U17.8
  Top 0.203: 17.52,41.73 U17.8 17.77,41.69 | D13.3 39.02,55.8 38.09,54.86 38.09,53.49 R13.1 37.94,54 v36.57,55.37 | v24.88,54.1 24.88,53.59 21.83,50.55 v21.83,46.2
  Bottom 0.203: v24.88,54.1 29.45,54.1 30.98,55.78 36.06,55.78 v36.57,55.37 | v21.83,46.2 v15.99,46.2
D5
  Top 0.203: R14.2 JP1.6
D5_IN  (via drill 0.5)
  Top 0.178: v12.13,45.06 12.18,44.7 12.18,41.7
  Top 0.203: D14.3 35.38,51.99 36.57,50.8 R14.1
  Top 0.254: 35.38,51.99 35.38,53.17 v35.8,53.85 | v31.74,54.1 v31.74,47.5 | 12.18,41.7 U17.15
  Bottom 0.178: v12.13,45.06 22.44,45.06 23.74,46.48
  Bottom 0.203: 23.74,46.48 28.51,46.48 29.45,47.5 v31.74,47.5
  Bottom 0.254: v35.8,53.85 31.99,53.85 v31.74,54.1
D6
  Top 0.203: R15.2 40.88,48.26 41.14,48.01 44.19,48.01 JP1.7
D6_IN  (via drill 0.5)
  Top 0.203: R15.1 37.68,48.01 36.31,48.01 35.38,48.94 D15.3 35.38,49.87 v35.8,50.29 | v11.45,49.38 11.42,48.01 11.17,47.75 11.17,41.68 U17.16
  Bottom 0.203: v35.8,50.29 33.26,50.29 33.01,50.55 24.88,50.55 23.13,49.38 v11.45,49.38
D7
  Top 0.203: R16.2 JP1.8
D7_IN  (via drill 0.5)
  Top 0.178: v18,36.45 18,34.21 19.12,33.1 19.14,29.06 18.3,28.22 18.18,28.12 16.88,26.82 16.88,26 U17.40
  Top 0.203: R16.1 D22.3 35.8,46.31 v36.06,46.99 | v31.76,41.45 v31.76,45.9
  Bottom 0.203: v18,36.45 22.32,36.45 27.09,41.48 v31.76,41.45 | v31.76,45.9 34.81,45.9 v36.06,46.99
D8
  Top 0.254: R1.2 JP2.1
D8_IN  (via drill 0.5)
  Top 0.178: v18.81,35.15 19.04,34.72 19.8,33.96 19.8,28.65 18.76,27.61 18.25,27.38 17.79,26.92 17.74,26.07 U17.41
  Top 0.203: D1.3 35.38,40.81 v36.19,39.42 | 17.77,26.09 U17.41
  Top 0.406: D1.3 38.19,41.91 R1.1
  Bottom 0.203: v36.19,39.42 36.13,39.12 35.37,37.92 25.47,37.92 23.05,35.56 19.14,35.56 v18.81,35.15 18.62,34.96
D9
  Top 0.406: R2.2 41.9,38.35 42.66,39.12 JP2.2
D9_IN  (via drill 0.5)
  Top 0.178: v20.06,34.8 20.06,34.44 20.33,34.16 20.33,28.25 19.19,27.1 18.63,26.85 18.48,26.7 18.51,26.03 U17.42
  Top 0.203: D2.3 35.3,38.1 35.55,37.85 35.55,37.34 v36.31,36.5 | 18.53,26.05 U17.42
  Top 0.406: D2.3 38.19,38.1 R2.1
  Bottom 0.203: v36.31,36.5 29.48,36.5 27.95,34.8 v20.06,34.8
D10
  Top 0.406: R3.2 41.14,35.31 42.41,36.58 JP2.3
D11  (via drill 0.5)
  Top 0.203: v66.28,48.51 66.28,62.48 66.03,62.74 66.03,65.02 | v54.09,48.51 v54.09,34.04 | R4.2 40.73,30.48 38.95,32.26 38.95,32.99 39.49,33.53 40.35,33.53 41.39,32.49 41.98,32.49 43.5,34.01 44.41,34.01 JP2.4
  Top 0.254: JP2.4 44.34,34.04 | JP8.4 67.05,66.04 66.03,65.02
  Bottom 0.254: v66.28,48.51 v54.09,48.51 | v54.09,34.04 JP2.4
D12  (via drill 0.5)
  Top 0.203: JP8.1 64.76,62.99 65.52,62.23 65.52,50.04 v65.27,49.78 | v53.15,49.78 v53.15,31.5
  Top 0.254: JP2.5 44.34,31.5 R5.2
  Bottom 0.254: v65.27,49.78 v53.15,49.78 | v53.15,31.5 JP2.5
D13  (via drill 0.5)
  Top 0.203: v52.31,45.97 v52.31,30.23
  Top 0.254: JP2.6 44.34,28.96 R6.2 | v67.3,45.97 JP8.3
  Bottom 0.203: v52.31,45.97 v67.3,45.97 | JP2.6 45.46,28.96 47.23,30.23 v52.31,30.23
  Bottom 0.254: 67.05,46.23 v67.3,45.97
DTR
  Top 0.203: R63.1 50.28,15.24 50.79,14.73 52.31,14.73 52.57,14.48 C4.1
E
  Top 0.203: 12.94,25.9 U17.35 12.69,25.81 12.69,25.4 13.96,24.13 17.77,24.13 18.28,23.62 18.28,14.48 11.93,8.13 11.93,4.34 11.57,3.99 11.57,3.2 12.21,2.56 12.97,2.56 13.05,2.49 13.05,1.85 13.94,0.96 23.29,0.96 U$1.8
GND  (via drill 0.5)
  Top 0.178: C5.2 v4.31,44.42 4.26,44.42 | D26.1 9.63,57.21 9.26,56.84 9.26,51.71 v9.29,51.69
  Top 0.203: U$8.P$12 U$8.P$13 | U$8.P$10 18.27,53.35 18.28,53.34 | 18.28,53.34 U$8.P$8 U$8.P$7 | R41.1 5.27,65.05 5.25,65.2 v6.26,63.58 | 58.54,43.56 v58.66,43.43 | 18.28,53.34 17.26,53.34 17.26,53.98 U$8.P$12 | U10.P$6 U10.P$5 | U9.P$6 U9.P$5 | U17.53 23.87,30.98 v22.75,31.8 | U1.7 45.02,6.67 v44.44,7.11 | U$8.P$5 18.78,51.06 v19.45,50.29 | U12.4 83.78,32.41 83.66,32.54 | C1.1 v11.93,14.99 14.29,15.01 16.5,17.27 R62.1 | R52.1 9.03,2.64 v8.88,1.52 | U8.P$2 71.38,45.97 71.87,45.97 72.13,46.23 72.13,47.75 71.52,48.36 R53.1 71.52,48.87 v72.89,47.5 | 34.53,52.27 34.53,51.05 33.45,49.97 D15.1 34.28,48.97 34.28,47.75 33.28,46.75 D22.1 34.28,45.67 34.28,43.86 D1.1 33.33,42.86 34.28,41.91 34.28,40.05 D2.1 33.28,38.85 34.28,37.85 34.28,36.24 D3.1 33.33,35.24 34.53,34.04 34.53,32.68 D4.1 33.58,31.43 34.53,30.48 34.53,28.87 D5.1 33.33,27.62 34.28,26.67 34.28,25.06 D6.1 33.33,24.06 34.28,23.11 34.28,21.51 D7.1 33.84,20.51 34.28,20.07 34.28,18.37 D8.1 36.38,16.07 37.33,17.02 39.06,17.02 D32.1 | 34.53,52.27 D14.1 | D12.1 54.85,54.41 54.85,55.63 55.09,56.37 D11.1 54.85,57.2 54.85,58.67 55.09,59.67 D10.1 54.85,60.5 54.85,61.98 55.43,62.55 D9.1 56.19,63.06 v57.39,63.25 | v40.71,55.5 40.5,57.2 D13.1 | C3.- 76.63,53.58 | 34.53,52.27 34.53,54.61 v34.28,54.86 | U17.63 23.49,38.98 v22.98,38.48 | 32.38,4.98 U$1.1 | C6.2 30.35,63.12 30.98,63.75 v31.99,63.75 | U16.6 U16.5 | U16.5 57.98,15.42 R36.1 57.14,10.41 v55.62,9.14 55.48,9.28 U1.26 | U16.4 58.99,20.65 58.41,20.07 58.41,16.82 U16.5 | R60.1 54.6,23.37 v54.35,23.11 | C7.2 63.36,57.79 v62.22,58.17 61.2,57.15 C9.2 | D26.1 D27.1 | 21.38,57.72 21.08,57.75 20.82,57.66 17.43,57.66 D28.1 17,55.43 17.25,55.28 U$8.P$12
  Top 0.203: 78.81,40.64 78.66,40.64 D23.1 | C8.2 47.87,38.99 v48,39.12 | U$2.3 39.87,2.79 v38.85,3.81 | R31.1 84.62,26.98 85.16,26.44 85.16,24.05 R34.1 | D20.1 81.77,65.06 82.74,64.08 82.74,62.53 D19.1 81.72,61.5 82.77,60.45 82.77,58.95 D18.1 81.95,57.95 82.87,57.02 82.87,55.52 D17.1 81.95,54.52 82.9,53.57 82.9,52.22 D16.1
  Top 0.254: JP4.4 JP4.5 | R46.1 v54.35,23.11 | 78.81,40.64 R26.1 79.59,40.74 v76.95,40.89 | v83.5,33.91 83.66,33.15 83.66,32.54 | U3.2 68.57,29.97 v69.08,29.46 | v55.62,9.14 55.11,8.64 53.7,8.64 | 53.7,8.64 U1.25 | 53.7,8.64 52.31,8.64 50.82,8.33 50.82,6.3 52.31,6.1 53.61,6.1 U1.21 52.24,6.03 52.06,5.84 52.06,4.32 52.31,4.06 53.67,4.06 U1.18 | S2.2 69.1,73.89 70.6,72.14 70.6,67.06 JP8.6 | U17.22 11.13,35.78 v10.89,35.79 | C2.1 v11.93,14.99 | 60.11,42.75 59.86,42.75 R28.1 | U11.4 60.11,42.75 | 60.11,42.75 v58.66,43.43 | R51.1 v2.28,14.73 | v21.94,56.44 21.38,57.72 D29.1
  Top 0.406: U12.4 83.63,29.77 84.32,28.68 84.34,28.47 R31.1 | v80.76,42.67 79.75,41 R26.1 | U10.P$6 21.14,64.07 v20.56,64.01 | U9.P$6 32.31,63.82 v31.99,63.75 | R54.1 42.41,12.45 v42.41,11.18 | D21.1 87.12,69.05 86.43,69.39 83.5,69.42 83.48,69.29 83.48,66.87 | 83.48,66.87 83.84,66.87 v84.47,66.24 | 83.48,66.87 82.36,66.87 81.78,66.29 81.78,65.17 D20.1
  Top 0.61: U7.P$2 80.27,45.19 80.76,44.7 v80.76,42.67 | 76.63,53.58 v78.98,55.12
  Bottom 0.178: v4.31,44.42 4.25,44.33 4.31,44.27 | v9.29,51.69 9.29,51.44
  Bottom 0.203: 23.61,39.37 v22.98,38.48 23.36,39.12 | 54.35,64.01 54.09,64.26 | v22.75,31.8 22.88,31.88 | v44.44,7.11 44.44,6.35 | v19.45,50.29 19.04,50.55 | v8.88,1.52 9.13,1.52 | v78.98,55.12 78.98,54.86 | v72.89,47.5 72.89,48.01 | v57.39,63.25 56.38,63.5 | v34.28,54.86 34.03,54.86 | v62.22,58.17 61.46,56.9 | U4.22 27.64,10.96 27.42,11.18 | v48,39.12 47.74,39.37 | v38.85,3.81 38.85,3.56
  Bottom 0.254: RESET.2 RESET.1 S2.2 S2.1 | v10.89,35.79 11.42,35.81 | v11.93,14.99 7.36,12.7
  Bottom 0.406: JP4.4 90.92,42.67 | v20.56,64.01 20.82,64.26 | U$1.3 U$1.1 | v84.47,66.24 84.47,66.34 84.57,66.45
  Bottom 1.422: JP7.1 JP7.2 JP7.3 JP7.4
  other vias: 31.23,66.8 38.09,64.01 20.56,66.55
  pour Bottom: 0.24,0.25 94.99,0.25 94.99,75.95 0.24,75.95
  pour Top: 29.96,61.72 40.12,61.72 40.12,67.56 29.96,67.56
  pour Top: 19.55,61.98 30.22,61.98 30.22,67.31 19.55,67.31
HIGH_5V_REG
  Top 0.254: 67.81,33.75 U3.5
  Top 0.406: U6.S1 69.7,37.12 67.53,35.79 67.55,33.62 U3.5
IR  (via drill 0.5)
  Top 0.203: U17.25 8.52,33.38 8.12,33.78 v7.36,33.78
  Bottom 0.203: IR.1 4.82,36.32 v7.36,33.78
LCD0
  Top 0.203: U17.51 25.14,29.46 25.64,29.46 26.91,28.19 26.91,25.91 24.88,23.88 24.88,10.67 22.09,7.87 22.09,4.87 U$1.9
LCD1
  Top 0.203: U17.50 25.18,28.7 25.64,28.7 26.15,28.19 26.15,25.91 24.37,24.13 24.37,11.18 20.82,7.62 20.82,3.6 U$1.10
LCD2
  Top 0.203: U17.49 25.14,27.71 25.14,27.18 25.39,26.92 25.39,25.91 23.87,24.38 23.87,11.68 19.55,7.37 19.55,4.87 U$1.11
LCD3
  Top 0.203: U17.48 23.26,12.1 18.28,7.11 18.28,3.6 U$1.12
LCD4
  Top 0.203: U17.47 22.46,12.31 17.01,6.86 17.01,4.87 U$1.13
LCD5
  Top 0.203: U17.46 21.66,12.53 15.74,6.6 15.74,3.6 U$1.14
LCD6
  Top 0.203: U17.45 20.86,12.74 14.47,6.35 14.47,4.87 U$1.15
LCD7
  Top 0.203: U17.44 20.06,12.71 13.2,5.84 13.2,3.86 U$1.16
LED0  (via drill 0.5)
  Top 0.203: U17.33 9.82,25.98 v9.36,26.62 | D30.A 2.25,27.66 v2.28,28.45
  Bottom 0.203: v9.36,26.62 8.32,26.64 5.55,28.27 4.03,28.27 3.57,28.25 2.81,28.25 v2.28,28.45
LED1  (via drill 0.5)
  Top 0.203: U17.34 12.06,25.03 v10.15,24.38 | D31.A 2.28,13.46 3.8,14.99 3.8,18.8 v4.31,19.56
  Bottom 0.203: v10.15,24.38 7.86,24.38 6.65,25.32 5.88,25.32 4.31,23.88 v4.31,19.56
M0_DIR0  (via drill 0.5)
  Top 0.203: v11.04,30.25 9.51,30.23 U17.29 | v30.19,29.95 31.49,30.73 31.49,38.99 30.98,39.5 30.98,55.88 31.99,55.88 34.79,58.67 34.79,61.89 U9.P$9
  Bottom 0.203: v11.04,30.25 29.2,30.23 v30.19,29.95
M0_DIR1  (via drill 0.5)
  Top 0.178: 9.63,29.21 10.73,29.21 v11.06,28.91 | 30.98,38.63 30.98,33.88 28.79,31.7 28.79,29.52 v28.72,29.44
  Top 0.203: 9.63,29.21 U17.30 | 30.98,38.63 30.47,39.14 30.47,56.9 33.01,59.94 33.01,60.71 33.77,60.96 33.77,61.9 U9.P$11
  Bottom 0.203: v11.06,28.91 13.22,29.59 28.21,29.59 v28.72,29.44
M0_EN  (via drill 0.5)
  Top 0.203: v26.66,48.01 26.65,48.27 26.65,61.71 | U17.14 12.94,41.66 12.94,45.7 v14.24,46.99 | 26.65,61.71 26.66,61.72 | U9.P$12 33.06,61.72 v31.23,61.72 v31.22,61.71 26.65,61.71 | U9.P$10 34.26,60.43 v34.03,60.2
  Bottom 0.203: v34.03,60.2 32.25,60.2 v31.23,61.72 | v14.24,46.99 20.79,46.99 21.81,48.01 v26.66,48.01
M1_DIR0  (via drill 0.5)
  Top 0.178: 10.4,28.47 10.56,28.19 10.58,27.61 10.86,27.33 11.27,27.33 11.85,27.84 11.85,37.49 10.66,38.61 10.58,38.68 10.58,40.03 10.07,40.54 7.74,40.54 6.92,41.35 6.92,44.15 6.77,44.3 6.77,54.38 7.23,54.84 v7.23,54.91
  Top 0.203: U10.P$9 23.36,62.14 23.36,61.72 23.87,61.21 23.87,60.2 23.31,59.49 23.31,55.42 v22.6,54.86 | 9.58,28.7 10.4,28.47
  Top 0.254: 9.58,28.7 U17.31
  Bottom 0.178: v22.6,54.86 14.9,54.86 14.57,55.19 7.51,55.19 v7.23,54.91
M1_DIR1  (via drill 0.5)
  Top 0.178: v7.84,28.47 7.84,28.4 8.52,27.71 9.39,27.71 U17.32
  Top 0.203: U10.P$11 22.34,62.16 22.34,60.83 20.08,60.83 19.52,61.44 19.55,62.79 18.79,63.4 7.61,63.4 7.36,64.26 7.36,67.06 6.59,67.56 1.77,67.56 1.01,66.8 1.01,29.46 v3.55,29.46
  Bottom 0.178: 7.61,28.52 7.79,28.52 v7.84,28.47
  Bottom 0.203: v3.55,29.46 5.83,29.46 7.61,28.52
M1_EN  (via drill 0.5)
  Top 0.178: 6.59,56.9 6.59,55.63 6.37,55.37 6.37,44.25 6.52,44.02 6.52,40.87 6.98,40.41 6.98,40.03 7.25,39.75 9.43,39.75 U17.17
  Top 0.203: U10.P$12 21.02,62.17 v20.82,61.98 | 9.39,39.86 U17.17 | U10.P$10 22.83,60.98 v23.1,60.71 | v6.85,61.47 6.59,60.96 6.59,56.9
  Bottom 0.203: v6.85,61.47 20.31,61.47 v20.82,61.98 22.09,60.71 v23.1,60.71
MISO  (via drill 0.5)
  Top 0.178: 13.78,41.54 13.78,29.57 v15.18,28.42
  Top 0.203: D5.3 35.38,27.77 v36.06,28.7 | 13.78,41.54 U17.13
  Top 0.254: D5.3 37.24,28.11 37.58,28.19 37.68,28.19 R5.1
  Bottom 0.178: v15.18,28.42 28.21,28.42 29.63,27.15
  Bottom 0.203: v36.06,28.7 36.06,27.94 34.28,27.18 30.22,27.18 30.19,27.15 29.63,27.15
MOSI  (via drill 0.5)
  Top 0.203: D4.3 35.38,30.82 v36.31,32 | U17.12 14.46,33.28 v14.65,32.69
  Top 0.254: D4.3 R4.1
  Bottom 0.203: v14.65,32.69 25.69,32.69 26.41,32 32.76,32 33.77,31.75 36.06,31.75 v36.31,32
N$1
  Top 0.254: JP9.D- 61.91,12.14 60.44,10.67 60.44,4.06 59.17,2.79 53.7,2.79 U1.16
N$2
  Top 0.254: JP9.D+ 62.24,3.58 60.75,2.18 53.83,2.18 U1.15
N$3
  Top 0.203: C2.2 9.78,12.19 8.37,12.19 7.88,11.7 Y1.P$2 6.59,14.22 5.07,15.75 5.07,31.75 6.09,32.77 6.09,34.8 6.59,35.31 8.12,35.31 8.44,34.98 U17.23
  Top 0.254: 9.53,35.05 U17.23
N$4
  Top 0.203: C1.2 9.29,19.03 Y1.P$1 6.59,22.35 5.58,23.37 5.58,30.99 6.59,32 6.59,34.54 6.85,34.8 7.86,34.8 8.48,34.18 U17.24
N$5
  Top 0.203: R53.2 68.67,48.67 68.14,47.83 68.14,46.05 68.44,45.87 69.04,45.8 U8.P$5
N$6  (via drill 0.5)
  Top 0.203: v13.2,7.37 19.29,13.21 19.29,25.95 U17.43 | R55.2 29.89,8.84 v29.94,8.94 R55.2
  Bottom 0.203: v29.94,8.94 29.5,7.72 14.09,7.75 v13.2,7.37
N$7
  Top 0.406: JP4.1 R56.2
N$8  (via drill 0.5)
  Top 0.178: 17.26,51.05 17.26,50.93 16.86,50.52 12.54,50.52 v11.88,51.18 | C5.1 5.15,47.22 5.63,47.7 5.63,49.73 4.84,50.52 v4.71,50.52
  Top 0.203: 17.26,51.05 17.26,51.64 U$8.P$2
  Bottom 0.178: v11.88,51.18 11.01,51.18 10.07,50.37 5.25,50.37 v4.71,50.52
N$9
  Top 1.016: JP9.VBUS 65.72,12.9 68.32,13.72 F2.1
N$10  (via drill 0.5)
  Top 0.203: U1.22 52.09,6.67 v51.68,7.29 | v47.79,6.35 47.79,1.96 47.18,1.35 43.83,1.35 D34.C
  Bottom 0.203: v51.68,7.29 47.82,6.38 v47.79,6.35
N$11  (via drill 0.5)
  Top 0.203: R57.2 35.96,11.84 v36.36,11.43 | v40.83,11.18 40.83,7.34 D34.A
  Bottom 0.203: v36.36,11.43 40.58,11.43 v40.83,11.18
N$12  (via drill 0.5)
  Top 0.203: D33.3 v70.09,23.11 | v64.76,21.34 64.76,23.22 R42.2
  Bottom 0.203: v70.09,23.11 66.54,23.11 v64.76,21.34
N$13  (via drill 0.5)
  Top 0.203: v12.18,20.57 13.55,20.57 R61.1
  Top 0.406: R61.1 R62.2
  Bottom 0.203: U4.2 11.14,21.61 v12.18,20.57
N$14  (via drill 0.5)
  Top 0.203: U1.2 47.98,9.93 v48.5,9.4 | v51.04,9.4 51.04,12.55 R63.2
  Bottom 0.203: v48.5,9.4 v51.04,9.4
N$15
  Top 0.203: U$2.2 37.28,7.11 35.58,5.41 33.72,5.41 | 33.75,5.38 33.72,5.41 | 33.72,5.41 32.68,6.45 28.77,6.45 U$1.5
N$16
  Top 0.203: R64.2 26.99,7.16 25.9,5.51 25.9,4.22 26.51,3.58 31.02,3.58 U$1.2
N$28
  Top 0.406: U2.D1 66.4,18.96 U2.D1@ | U2.D2 67.7,18.59 U2.D2@
  pour Top (no thermals): 66.54,19.05 67.55,19.05 67.55,18.54 66.54,18.54
N$30
  Top 0.203: U12.7 81.14,41.78 82.41,43.05 82.82,43.05 R25.1 83.69,43.28 Q3.1
N$33  (via drill 0.5)
  Top 0.406: JP4.6 94.22,44.2 94.22,25.91 v90.21,21.87
  Top 0.813: F1.2 76.19,18.29 v74.92,19.56
  Top 1.676: F1.2 78.87,17.64 82.03,14.48 84.4,14.48 Q1.3
  Bottom 0.813: v74.92,19.56 78.22,19.56 78.73,20.07 88.38,20.07 v90.21,21.87
N$34
  Top 0.406: R24.1 84.19,38.61 U12.5 83.56,37.16 83.56,39.88 R26.2
N$35
  Top 0.203: 59.02,38.35 59.02,38.2 58.16,37.34 58.16,34.95 R58.2
  Top 0.254: R28.2 59.02,38.35 59.17,38.35 61.84,41.02 U11.3 61.97,42.88 61.97,44.2 60.8,45.36 R29.1
N$36
  Top 0.406: R34.2 85.92,20.57 86.58,19.91 86.6,17.93 Q1.1
N$38
  Top 0.406: R27.1 84.57,35.31 82.46,34.59 82.41,33.63 U12.3 82.39,29.34 R31.2
N$39
  Top 0.203: 56.28,18.54 R36.2 57.19,17.98 57.19,21.36 57.95,22.12 60.49,22.12 61.08,21.54 U16.3
  Top 0.254: R36.2 R35.1
N$41
  Top 0.254: R41.2 2.53,65.79 D25.C
N$42
  Top 0.406: U6.D1 69.7,39.02 U6.D1@ U6.D2@ 71,38.65 U6.D2
  pour Top (no thermals): 69.84,39.12 70.86,39.12 70.86,38.61 69.84,38.61
N$43
  Top 0.203: R43.2 88.23,10.13 88.38,10.13 89.47,11.23 89.47,14.88 89.93,15.34 92.55,15.34 POWER.P$1
N$44
  Top 0.406: U5.D1 71.46,32.37 U5.D1@ | U5.D2 71.83,33.67 U5.D2@
  pour Top (no thermals): 71.36,33.53 71.87,33.53 71.87,32.26 71.36,32.26
N$45  (via drill 0.5)
  Top 0.203: Q4.1 v89.74,27.7 v89.73,27.71
  Top 0.406: R30.1 78.63,30.23 v79.26,29.97 80,30.79 U12.1
  Bottom 0.203: v89.73,27.71 81.52,27.71 v79.26,29.97
  Bottom 0.406: 79.49,29.97 v79.26,29.97
N$46
  Top 0.203: JP8.5 R39.2
N$51  (via drill 0.5)
  Top 0.203: Q2.1 81.01,19.19 81.02,18.16 81.68,17.48 v81.98,17.17
  Top 0.254: R44.2 88.38,15.24 88.38,12.6 R43.1
  Top 0.406: v87.11,15.24 88.38,15.24
  Bottom 0.406: v81.98,17.17 84.77,17.17 v87.11,15.24
N$52  (via drill 0.5)
  Top 0.203: R45.1 51.4,25.5 51.55,24.64 51.55,21.95 R46.2 | U17.55 26.34,32.58 26.34,30.3 29.71,27.18 29.71,18.29 v33.77,14.22
  Top 0.254: v51.3,18.03 51.3,19.46 R46.2
  Bottom 0.254: v33.77,14.22 48,14.22 v51.3,18.03
N$57
  Top 0.203: D30.C R51.2
N$62
  Top 0.203: D31.C 5.83,9.68 8.04,7.47 8.73,7.47 9.06,7.14 9.06,6.07 R52.2
PWR_SW  (via drill 0.5)
  Top 0.203: Q2.2 83.01,19.9 | 83.81,17.04 Q1.2
  Top 0.254: 83.33,18.8 v85.56,18.52 | v90.06,18.95 88.48,20.32 R44.1 | U2.S2 70.17,22.16 D33.1 73.73,18.51 v74.18,18.06
  Top 1.676: 83.01,19.9 83.33,18.8 83.81,17.04
  Bottom 0.203: v74.18,18.06 80.51,18.06 80.99,18.54 85.54,18.54 v85.56,18.52 89.14,18.52 v90.06,18.95
RESET  (via drill 0.5)
  Top 0.178: 5.58,37.41 5.58,39.9 3.95,41.53 3.14,41.53 R40.2
  Top 0.203: 52.06,16.39 C4.2 v52.82,18.54 53.33,19.3 53.33,22.35 52.57,23.11 v52.57,23.37 52.82,24.13 52.82,27.69 53.33,28.19 54.85,28.19 54.85,49.28 | R39.1 70.2,57.51 71.87,59.18 | 71.87,59.18 71.87,71.73 72.51,72.36 73.45,72.36 74.13,71.68 74.13,70.21 RESET.3 | 74.94,69.34 RESET.3 | 57.65,53.34 57.65,58.67 v57.39,58.93 | v72.76,60.43 71.87,59.18 | U17.20 9.42,37.34 5.65,37.34 5.58,37.41 5.58,33.53 4.31,32.26 4.31,27.74 v3.85,26.7 | v91.58,25.17 91.58,26.67 R56.1 | RESET.4 RESET.3
  Top 0.254: 57.65,53.34 54.85,49.28
  Bottom 0.203: v52.57,23.37 58.89,26.14 75.86,26.16 78.37,25.15 91.56,25.15 v91.58,25.17 | v52.82,18.54 51.3,20.07 41.65,20.07 38.98,22.48 38.85,22.61 30.47,22.61 28.69,23.88 11.67,23.88 10.66,25.15 8.63,25.15 6.98,26.01 4.26,26.06 3.8,26.67 v3.85,26.7 | v57.39,58.93 72.13,58.93 v72.76,60.43 | 74.94,69.34 RESET.3
RS  (via drill 0.5)
  Top 0.203: U17.36 13.66,25.19 14.21,24.64 18.79,24.64 18.79,14.22 12.44,7.87 v12.44,3.58
  Bottom 0.203: v12.44,3.58 25.94,3.58 U$1.6
RX  (via drill 0.5)
  Top 0.203: U1.1 43.26,10.57 v42.41,9.96 | v6.34,23.82 6.34,30.99 U17.28 | v32.68,10.64 32.68,7.39 v33.75,6.6
  Bottom 0.203: v33.75,6.6 8.88,6.6 6.34,8.64 v6.34,23.82 | v42.41,9.96 33.42,9.96 v32.68,10.64
SCK  (via drill 0.5)
  Top 0.178: 16.25,35.56 16.25,34.44 18.25,32.44 18.25,29.46 v16.55,27.64
  Top 0.203: R6.1 36.65,24.13 D6.3 35.38,24.47 v35.8,24.64 | 15.23,41.55 U17.11 | 15.23,40.16 16.25,39.14 16.25,35.56
  Top 0.254: 15.23,41.55 15.23,40.16
  Bottom 0.203: 18.28,25.15 29.2,25.15 30.98,23.62 34.28,23.62 v35.8,24.64
  Bottom 0.254: v16.55,27.64 18.28,25.15
SCL0
  Top 0.254: R7.2 42.92,22.86 JP2.9
SCL_IN  (via drill 0.5)
  Top 0.178: v4.77,48.97 R38.1 | R38.1 | 21.33,36.32 21.27,36.32 21.1,36.5 19.95,36.5 18.73,38.25 18.73,39.57 19.17,40.79 19.17,41.49 U17.6 19.22,41.63 19.22,42.77 18.43,43.56 18.43,47.14 17.34,48.23 17.34,49.02 18.28,49.96 U$8.P$4
  Top 0.203: R7.1 37.94,22.71 37.07,21.84 v35.8,21.34 35.37,20.9 D7.3 35.63,19.81 | U$8.P$4 | 19.29,41.61 U17.6 | v24.37,26.42 24.37,26.92 23.61,27.43 23.61,28.45 21.33,30.73 21.33,36.32 | v31.49,25.09 v31.49,21.34 | 17.34,49.02 13.6,49.02 v12.23,47.65
  Bottom 0.178: 10.3,47.65 9.06,47.65 7.74,48.97 v4.77,48.97
  Bottom 0.203: v31.49,21.34 v35.8,21.34 | v24.37,26.42 28.95,26.16 30.72,25.4 v31.49,25.09 | v12.23,47.65 10.3,47.65
SDA0
  Top 0.254: R8.2 42.92,20.32 JP2.10
SDA_IN  (via drill 0.5)
  Top 0.178: R37.1 3.93,57.81 v4.82,56.49 | v20.87,27.61 20.82,27.66 20.82,36.07 19.75,36.07 18.3,37.9 18.3,39.6 18.4,40.64 18.4,41.52 U17.7 18.43,41.61 18.43,42.52 16.96,43.99 16.96,47.22 v16.14,48.16 | U$8.P$6 19.63,52.33 20.36,53.06 20.36,56.34 v20.31,56.39
  Top 0.203: D8.3 37.84,19.56 | 37.84,19.56 37.84,20.22 R8.1 | v20.26,48.21 20.26,51.59 19.54,52.33 U$8.P$6 | v27.93,27.61 27.93,17.02 v31.23,15.49 | 39.61,18.29 v39.36,18.03 37.84,19.56 | 18.53,41.65 U17.7
  Bottom 0.178: v4.82,56.49 5.2,56.39 16.75,56.39 | v16.14,48.16 20.03,48.13 v20.26,48.21
  Bottom 0.203: v20.87,27.61 v27.93,27.61 | v31.23,15.49 38.34,15.49 v39.36,18.03 | 16.75,56.39 17.57,55.73 18.84,55.73 19.55,56.39 v20.31,56.39
SERVO0
  Top 0.254: JP3.1 R47.2
SERVO0_IN
  Top 0.178: D26.3 7.53,55.86 7.99,55.55 7.99,54.43 7.41,54 7.41,41.55 7.86,41.1 10.15,41.1 10.99,40.26 10.99,38.91 12.36,37.54 12.36,27.43 12.61,27.18 13.88,27.18 14.19,26.87 14.44,26 U17.37
  Top 0.254: D26.3 7.53,60.11 9.13,61.98 9.13,61.82 R47.1
SERVO1
  Top 0.254: JP3.2 R48.2
SERVO1_IN  (via drill 0.5)
  Top 0.178: U17.38 15.13,26.64 14.09,27.66 13.68,27.69 12.84,28.52 12.84,37.8 11.83,39.01 v11.83,40.03 | v8.5,41.88 8.5,58.29 8.9,58.7 11.06,58.7 D27.3
  Top 0.254: D27.3 11.08,61.13 11.93,61.98 R48.1
  Bottom 0.178: v11.83,40.03 10.23,40.03 v8.5,41.88
SERVO2
  Top 0.254: JP3.3 R49.2
SERVO2_IN  (via drill 0.5)
  Top 0.178: U17.39 16.06,26.78 15.33,27.51 14.93,27.51 13.38,29.06 13.38,38.89 v13.02,39.06 | v10.07,42.27 10.07,52.78 14.77,57.56 14.77,58.55 D28.3
  Top 0.254: D28.3 14.89,61.55 14.47,61.98 R49.1
  Bottom 0.178: v13.02,39.06 13.02,41.02 12.26,41.83 10.43,41.83 v10.07,42.27
SERVO3
  Top 0.254: JP3.4 R50.2
SERVO3_IN  (via drill 0.5)
  Top 0.178: U17.54 24.09,31.78 22.52,33.35 22.52,36.96 v21.68,37.8 | v25.03,42.62 26.68,42.62 27.95,43.89 27.95,56.19 v28.23,56.64 | v22.52,58.04 22.11,58.67 D29.3
  Top 0.254: D29.3 18.7,61.4 R50.1
  Bottom 0.178: v21.68,37.8 21.68,40.08 24.25,42.65 25.01,42.65 v25.03,42.62 | v28.23,56.64 24.04,56.64 v22.52,58.04
SS  (via drill 0.5)
  Top 0.203: 35.38,34.37 35.97,34.37 v37.58,33.27 | 16.25,41.4 U17.10 15.99,41.51 15.99,40.18 17.01,39.17 v17.01,34.8
  Top 0.406: D3.3 35.38,34.37 36.84,34.37 R3.1
  Bottom 0.203: v17.01,34.8 17.72,33.63 26.1,33.63 26.89,32.82 35.19,32.82 35.98,33.27 v37.58,33.27
SW1  (via drill 0.5)
  Top 0.178: U17.9 16.86,40.56 v17.46,39.95
  Top 0.203: v25.64,62.48 25.64,60.71 26.15,60.2 26.15,49.53 25.64,49.02 v25.64,44.37 | 17.01,41.73 U17.9 | S2.4 S2.3
  Bottom 0.178: v17.46,39.95 18.46,39.95 20.39,41.88 21.96,41.88 24.35,44.27 25.54,44.27 v25.64,44.37
  Bottom 0.203: S2.3 59.71,66.29 33.01,66.29 30.22,64.01 26.91,64.01 v25.64,62.48 | v25.64,44.37 25.67,44.12
TX  (via drill 0.5)
  Top 0.178: U17.27 11.01,31.78 v11.09,31.75 | v31.43,29.16 31.43,27 30.72,26.39 30.72,19.05
  Top 0.203: U1.5 42.76,7.97 v42.66,7.87 | 30.72,19.05 37.94,10.95 39.31,9.65 v39.31,7.87
  Bottom 0.178: v11.09,31.75 11.78,31.75 12.49,31.04 29.81,31.04 31.46,30.5 v31.43,29.16
  Bottom 0.203: v42.66,7.87 v39.31,7.87
USB_5V  (via drill 0.5)
  Top 0.203: v43.93,9.2 44.44,9.14 44.96,8.62 U1.4 47.75,8.62 49.14,7.24 | v31.69,9.2 31.38,9.91 R55.1 | 49.14,7.24 49.27,7.11 49.27,5.08 v49.01,4.83 | 66.28,16.47 F2.2 U16.8 63.64,13.39 63.52,12.98 63.52,4.88 v63.59,4.8 | U2.S1 65.95,17.86 65.78,18.29 65.78,21.34 66.79,22.61 66.79,23.37 67.48,24.05 D33.2 73.8,24.13 | R54.2 47.74,12.7 49.52,10.92 49.52,7.62 49.14,7.24
  Top 0.254: U1.20 55.07,5.38 v55.62,4.83 | 46.38,8.64 U1.4
  Top 0.305: 66.28,16.47 U2.S1
  Bottom 0.203: v43.93,9.2 v31.69,9.2 | v63.59,4.8 55.64,4.8 v55.62,4.83
  Bottom 0.254: v49.01,4.83 v55.62,4.83
USBGATE  (via drill 0.5)
  Top 0.203: v64.76,19.81 64.51,19.81 63.67,20.65 U16.1 63.49,20.78 63.49,22.61 62.73,23.37 R42.1 R60.2 | v67.35,21.18 67.05,20.07 U2.G2 | U2.G1 67.05,17.27 67.3,17.02 68.57,17.02 69.08,17.53 v69.08,19.41
  Bottom 0.203: v64.76,19.81 67.2,21.23 v67.35,21.18 v69.08,19.41
VIN  (via drill 0.5)
  Top 0.203: F1.1 v71.24,10.67
  Top 0.254: 72.13,17.64 F1.1 | R35.2 55.01,12.8 v55.87,11.18
  Top 1.676: J1.PWR 77.33,12.43 F1.1
  Bottom 0.203: v71.24,10.67 67.05,10.67 66.03,8.38 60.7,8.38 58.16,11.18 v55.87,11.18
VIN_F
  Top 0.203: R45.2 56.12,25.91 56.38,26.16 | 58.77,26.26 58.92,26.16 | U10.P$1 U10.P$2 | U9.P$1 U9.P$2 | R33.2 66.03,41.55 | 66.03,41.55 65.93,41.55 64.51,40.13 64.51,37.64 U11.8 64.38,34.42 64,34.04 64,32.11 R32.2 63.9,26.24 63.74,26.16 | R29.2 63.74,45.72 66.03,43.43 66.03,41.55 | 67.81,28.19 67.69,28.19 67.62,28.26 | 77.97,33.02 75.94,33.02 75.17,32.26 75.17,30.48
  Top 0.254: U12.8 79.9,35.28 77.97,33.02 | U3.3 70.12,30.96 71.11,29.97 | 75.17,30.48 74.41,29.72 74.41,26.42 74.67,26.16
  Top 0.406: 72.56,31.17 U5.S1 | U9.P$1 35.87,66.11 41.27,69.22 | 28.69,71.63 28.69,67.82 24.44,66.36 U10.P$1
  Top 0.61: 72.56,31.17 71.11,29.97
  Top 0.813: U3.1 67.62,28.26
  Top 1.016: 71.11,29.21 70.86,28.19 67.81,28.19
  Top 1.676: 71.11,26.16 74.67,26.16 77.05,26.16 78.32,24.89 78.32,22.58 81.87,22.58 Q2.3 | 71.11,26.16 63.74,26.16 58.92,26.16 56.38,26.16 56.38,49.02 59.17,52.83 59.17,64.77 57.39,66.55 47.74,66.55 45.46,69.09 44.44,69.09 41.27,69.22 39.61,71.63 28.69,71.63 JP6.4 JP6.3 JP6.2 JP6.1 | 71.11,26.16 71.11,29.21 71.11,29.97

## Text on the board
tPlace: 1 | 1 | 0 | 0 | SW1 | 1 | Digital | Analog | RESET | 0 | 2 | 3 | SERVO | 0 | 5 | 4 | 1 | v0.1 | ISP | POWER | 2 | 3 | 2 | 3 | 4 | 1 | 5 | 0 | Analog | 6 | Vin | Digital | 7 | GND | 8 | GND | 9 | 5V | 10 | 3.3V | IR | 11 | RESET | 12 | 13 | GND | OFF | AREF | LED1 | SCL | SDA | LED0 | CONTRAST | LCD HEADER | ON | RX | 3-11V